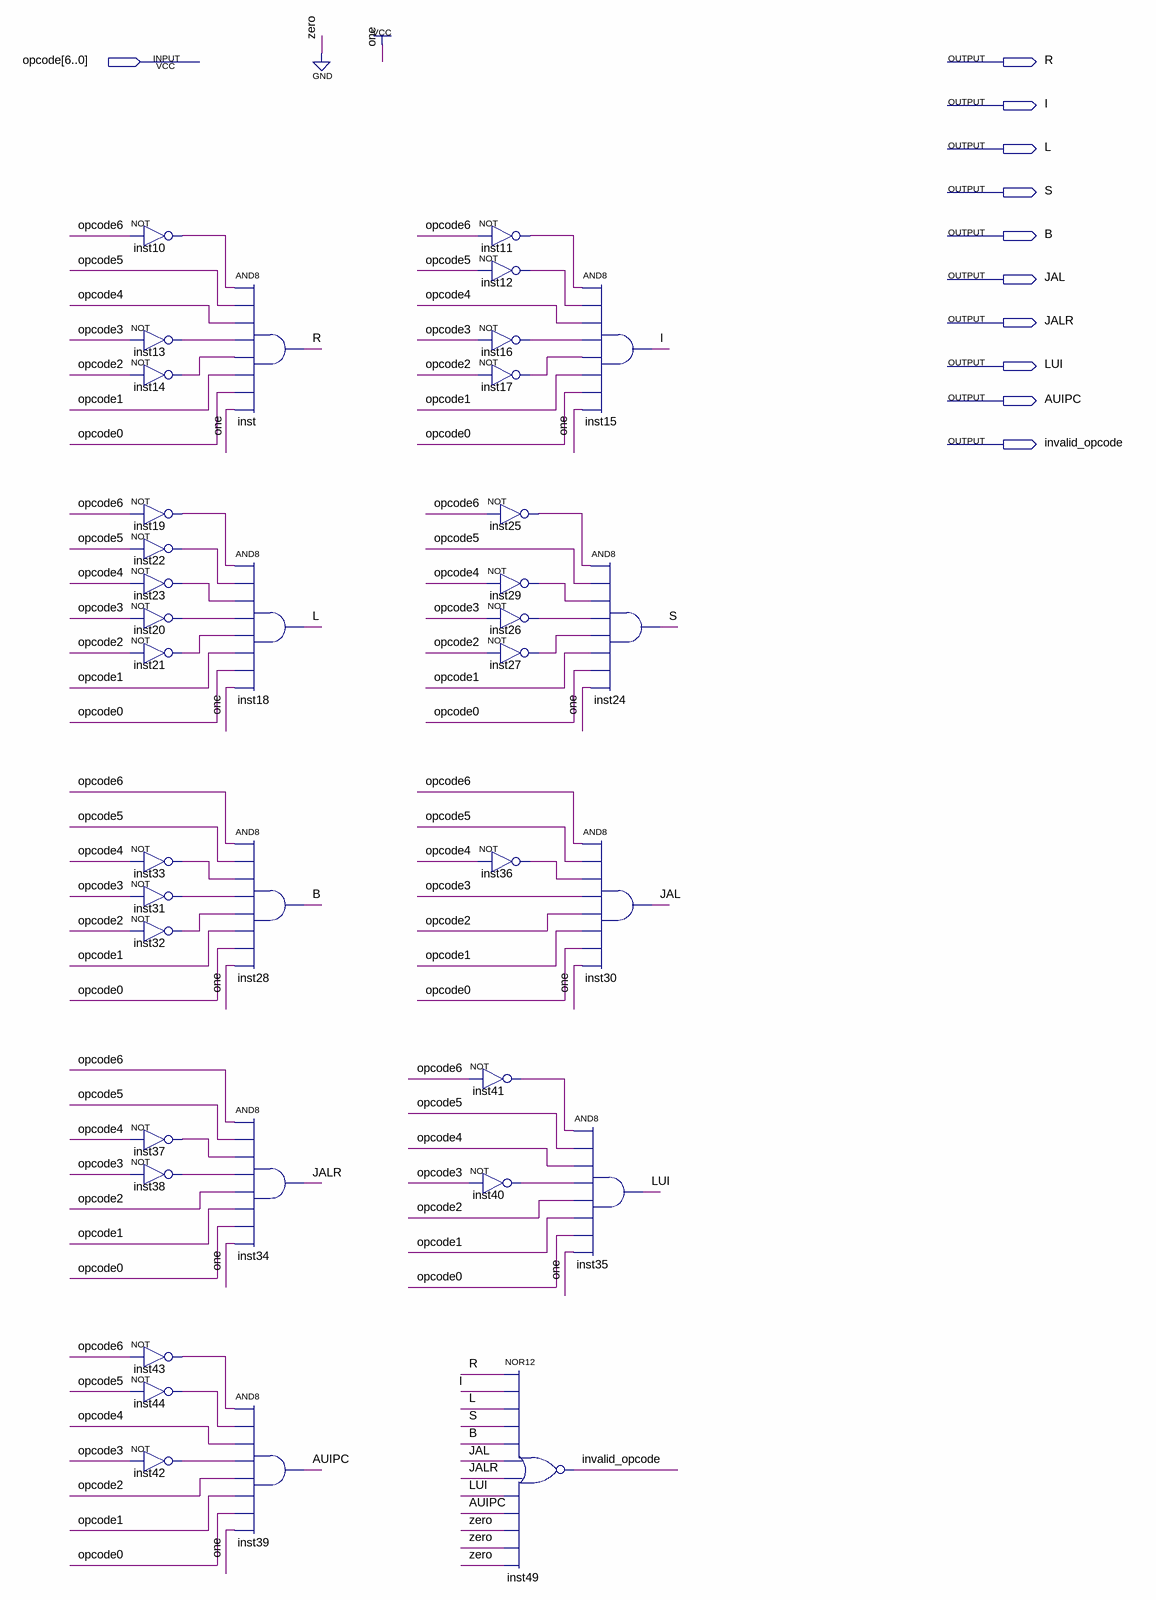
[diagram p0: schematic sheet]
// Quartus schematic OpDecoder.bdf as structural Verilog: 37 symbols, 11 pins
module OpDecoder (
  input  [6:0] opcode,
  output R,
  output I,
  output L,
  output S,
  output B,
  output JAL,
  output JALR,
  output LUI,
  output AUIPC,
  output invalid_opcode
);

  wire inst10_out, inst11_out, inst12_out, inst13_out, inst14_out, inst16_out, inst17_out, inst19_out,
       inst20_out, inst21_out, inst22_out, inst23_out, inst25_out, inst26_out, inst27_out, inst29_out,
       inst31_out, inst32_out, inst33_out, inst36_out, inst37_out, inst38_out, inst40_out, inst41_out,
       inst42_out, inst43_out, inst44_out;

  not inst10 (inst10_out, opcode[6]);
  not inst13 (inst13_out, opcode[3]);
  not inst14 (inst14_out, opcode[2]);
  not inst19 (inst19_out, opcode[6]);
  not inst22 (inst22_out, opcode[5]);
  not inst23 (inst23_out, opcode[4]);
  not inst20 (inst20_out, opcode[3]);
  not inst21 (inst21_out, opcode[2]);
  not inst33 (inst33_out, opcode[4]);
  not inst31 (inst31_out, opcode[3]);
  not inst32 (inst32_out, opcode[2]);
  not inst37 (inst37_out, opcode[4]);
  not inst38 (inst38_out, opcode[3]);
  not inst43 (inst43_out, opcode[6]);
  not inst44 (inst44_out, opcode[5]);
  not inst42 (inst42_out, opcode[3]);
  and inst (R, inst10_out, opcode[5], opcode[4], inst13_out, inst14_out, opcode[1], opcode[0], 1'b1);
  and inst18 (L, inst19_out, inst22_out, inst23_out, inst20_out, inst21_out, opcode[1], opcode[0], 1'b1);
  and inst28 (B, opcode[6], opcode[5], inst33_out, inst31_out, inst32_out, opcode[1], opcode[0], 1'b1);
  and inst34 (JALR, opcode[6], opcode[5], inst37_out, inst38_out, opcode[2], opcode[1], opcode[0], 1'b1);
  and inst39 (AUIPC, inst43_out, inst44_out, opcode[4], inst42_out, opcode[2], opcode[1], opcode[0], 1'b1);
  not inst11 (inst11_out, opcode[6]);
  not inst12 (inst12_out, opcode[5]);
  not inst16 (inst16_out, opcode[3]);
  not inst17 (inst17_out, opcode[2]);
  not inst25 (inst25_out, opcode[6]);
  not inst29 (inst29_out, opcode[4]);
  not inst26 (inst26_out, opcode[3]);
  not inst27 (inst27_out, opcode[2]);
  not inst36 (inst36_out, opcode[4]);
  not inst41 (inst41_out, opcode[6]);
  not inst40 (inst40_out, opcode[3]);
  nor inst49 (invalid_opcode, R, I, L, S, B, JAL, JALR, LUI, AUIPC, 1'b0, 1'b0, 1'b0);
  and inst15 (I, inst11_out, inst12_out, opcode[4], inst16_out, inst17_out, opcode[1], opcode[0], 1'b1);
  and inst30 (JAL, opcode[6], opcode[5], inst36_out, opcode[3], opcode[2], opcode[1], opcode[0], 1'b1);
  and inst35 (LUI, inst41_out, opcode[5], opcode[4], inst40_out, opcode[2], opcode[1], opcode[0], 1'b1);
  and inst24 (S, inst25_out, opcode[5], inst29_out, inst26_out, inst27_out, opcode[1], opcode[0], 1'b1);
endmodule
